# EAGLE design ASD2612 (EAGLE 6.3)
DATABASE: ./../../../../../Components/TinyCircuits_Part_Database.txt
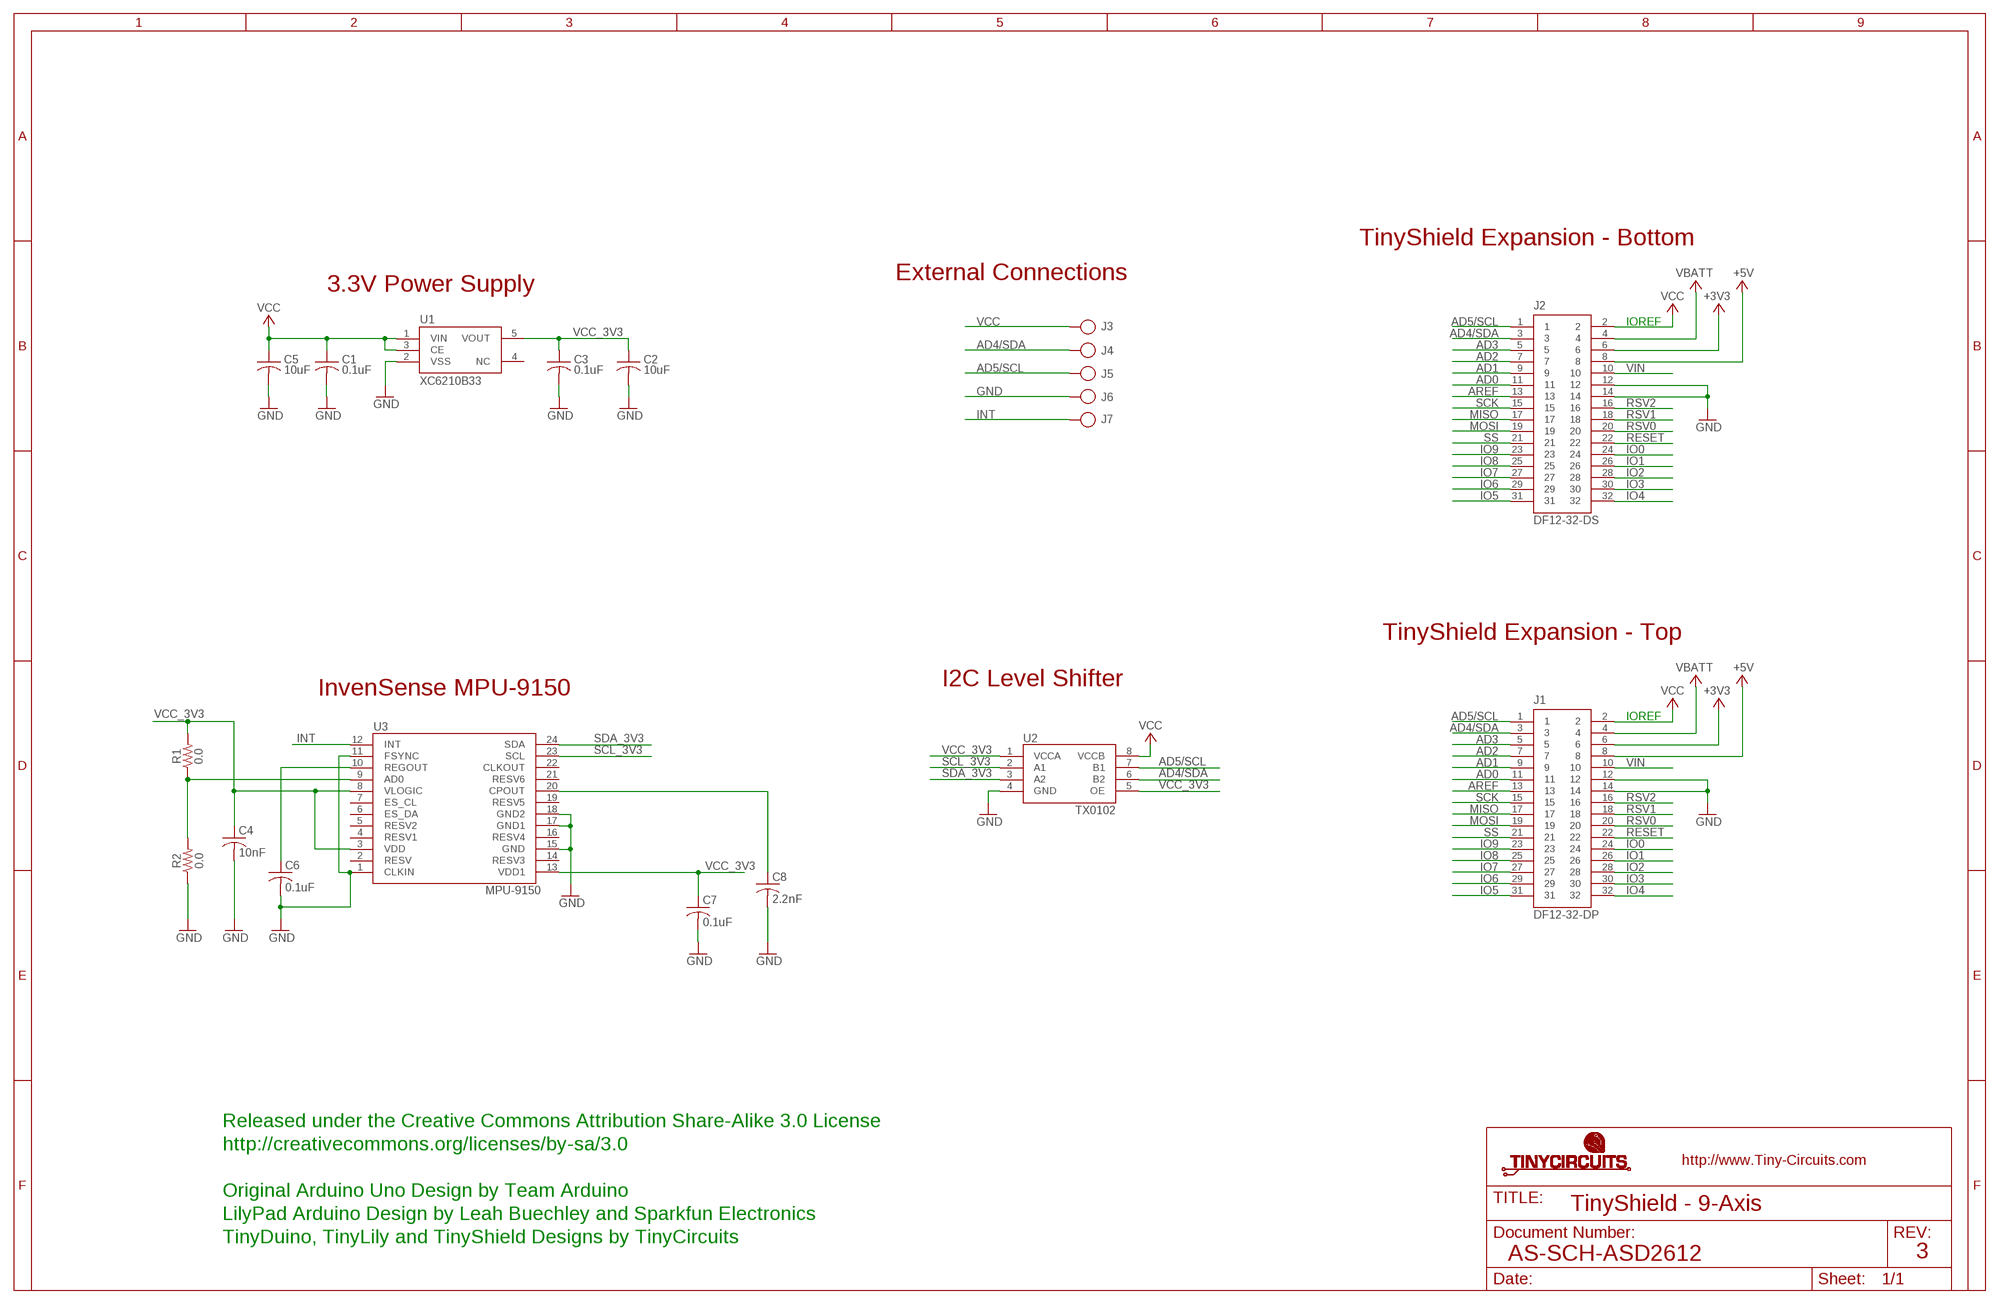
[diagram p0: schematic, sheet 1]

## Parts
C1  0.1uF  AS-ITM-00008  [C0402]
C2  10uF  AS-ITM-00045  [C0805]
C3  0.1uF  AS-ITM-00008  [C0402]
C4  10nF  AS-ITM-00084  [C0402]
C5  10uF  AS-ITM-00045  [C0805]
C6  0.1uF  AS-ITM-00008  [C0402]
C7  0.1uF  AS-ITM-00008  [C0402]
C8  2.2nF  AS-ITM-00085  [C0402]
J1  DF12-32-DP  AS-ITM-00015  [DF12-32-DP]
J2  DF12-32-DS  AS-ITM-00012  [DF12-32-DS]
J3  PIN_1X.1"  [1X.1"]
J4  PIN_1X.1"  [1X.1"]
J5  PIN_1X.1"  [1X.1"]
J6  PIN_1X.1"  [1X.1"]
J7  PIN_1X.1"  [1X.1"]
R1  0.0  AS-ITM-00076  [0402]
R2  AS-ITM-000760402_SHORT  [0402_SHORT]
U1  XC6210B33  AS-ITM-00046  [SOT-25]
U2  TX0102  AS-ITM-00073  [DQE(R-PX2SON-N8)]
U3  MPU-9150  AS-ITM-00081  [MPU-9150]

## Nets
+3V3: J1.6 J2.6
+5V: J1.8 J2.8
AD0: J1.11 J2.11
AD1: J1.9 J2.9
AD2: J1.7 J2.7
AD3: J1.5 J2.5
AD4/SDA: J1.3 J2.3 J4.1 U2.6(B2)
AD5/SCL: J1.1 J2.1 J5.1 U2.7(B1)
AREF: J1.13 J2.13
GND: C1.2 C2.2 C3.2 C4.2 C5.2 C6.2 C7.2 C8.2 J1.12 J1.14 J2.12 J2.14 J6.1 R2.1 U1.2(VSS) U2.4(GND) U3.1(CLKIN) U3.11(FSYNC) U3.15(GND) U3.17(GND1) U3.18(GND2)
INT: J7.1 U3.12(INT)
IO0: J1.24 J2.24
IO1: J1.26 J2.26
IO2: J1.28 J2.28
IO3: J1.30 J2.30
IO4: J1.32 J2.32
IO5: J1.31 J2.31
IO6: J1.29 J2.29
IO7: J1.27 J2.27
IO8: J1.25 J2.25
IO9: J1.23 J2.23
MISO: J1.17 J2.17
MOSI: J1.19 J2.19
N$1: C8.1 U3.20(CPOUT)
N$2: C6.1 U3.10(REGOUT)
N$3: R1.1 R2.2 U3.9(AD0)
RESET: J1.22 J2.22
RSV0: J1.20 J2.20
RSV1: J1.18 J2.18
RSV2: J1.16 J2.16
SCK: J1.15 J2.15
SCL_3V3: U2.2(A1) U3.23(SCL)
SDA_3V3: U2.3(A2) U3.24(SDA)
SS: J1.21 J2.21
VBATT: J1.4 J2.4
VCC: C1.1 C5.1 J1.2 J2.2 J3.1 U1.1(VIN) U1.3(CE) U2.8(VCCB)
VCC_3V3: C2.1 C3.1 C4.1 C7.1 R1.2 U1.5(VOUT) U2.1(VCCA) U2.5(OE) U3.3(VDD) U3.8(VLOGIC) U3.13(VDD1)
VIN: J1.10 J2.10
Unconnected: U1.4(NC) U3.2(RESV) U3.4(RESV1) U3.5(RESV2) U3.6(ES_DA) U3.7(ES_CL) U3.14(RESV3) U3.16(RESV4) U3.19(RESV5) U3.21(RESV6) U3.22(CLKOUT)

## Notes on the sheet
- TinyShield Expansion - Bottom
- External Connections
- 3.3V Power Supply
- IOREF
- TinyShield Expansion - Top
- I2C Level Shifter
- InvenSense MPU-9150
- IOREF
- 0.0
- Released under the Creative Commons Attribution Share-Alike 3.0 License
- http://creativecommons.org/licenses/by-sa/3.0
- Original Arduino Uno Design by Team Arduino
- TinyShield - 9-Axis
- LilyPad Arduino Design by Leah Buechley and Sparkfun Electronics
- TinyDuino, TinyLily and TinyShield Designs by TinyCircuits
- AS-SCH-ASD2612 | 3

## Library data of the parts
C1 C3 C6 C7 = tinycircuits:AS-ITM-00008: CAP CER 0.1UF 16V 10% X5R 0402; PARTNO: AS-ITM-00008
C2 C5 = tinycircuits:AS-ITM-00045: CAP CER 16UF 16V 20% X5R 0805; PARTNO: AS-ITM-00045
C4 = tinycircuits:AS-ITM-00084: CAP CER 10NF 25V 10% X7R 0402; PARTNO: AS-ITM-00084
C8 = tinycircuits:AS-ITM-00085: CAP CER 2.2NF 50V 10% X7R 0402; PARTNO: AS-ITM-00085
J1 = tinycircuits:AS-ITM-00015: CONN HEADER 32POS 3MM SMD 0.5MM; PARTNO: AS-ITM-00015
J2 = tinycircuits:AS-ITM-00012: CONN RECEPT 32POS 3MM SMD 0.5MM; PARTNO: AS-ITM-00012
J3-J7 = tinycircuits:PIN_1X.1": 1 Pin 0.100" Header
R1 = tinycircuits:AS-ITM-00076: RES 0.0 OHM 1/16W 1% 0402 SMD; PARTNO: AS-ITM-00076
R2 = tinycircuits:AS-ITM-00076: RES 0.0 OHM 1/16W 1% 0402 SMD; VALUE: SHORT
U1 = tinycircuits:AS-ITM-00046: IC REG LDO 3.3V .7A SOT-25; PARTNO: AS-ITM-00046
U2 = tinycircuits:AS-ITM-00073: TI 2-Bit Bidirectional Voltage-Level Translator; PARTNO: AS-ITM-00073; VALUE: TXS0102
U3 = tinycircuits:AS-ITM-00081: GYRO/ACCELEROMETER 9-AXIS 24LGA; PARTNO: AS-ITM-00081

## Board
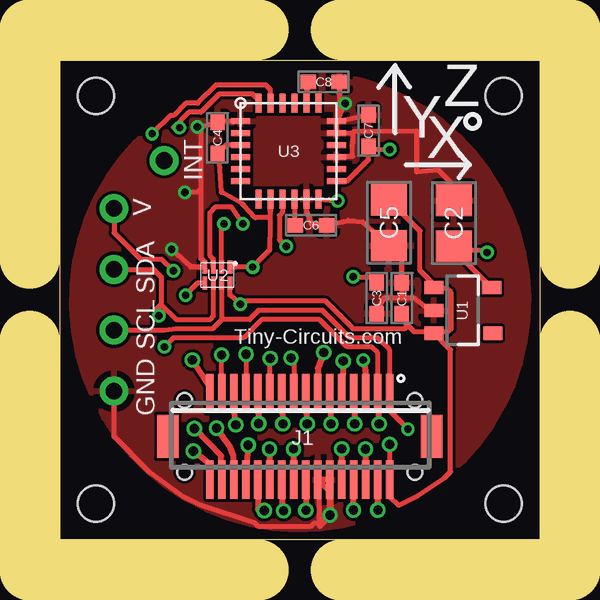
[diagram p1: board, top side]
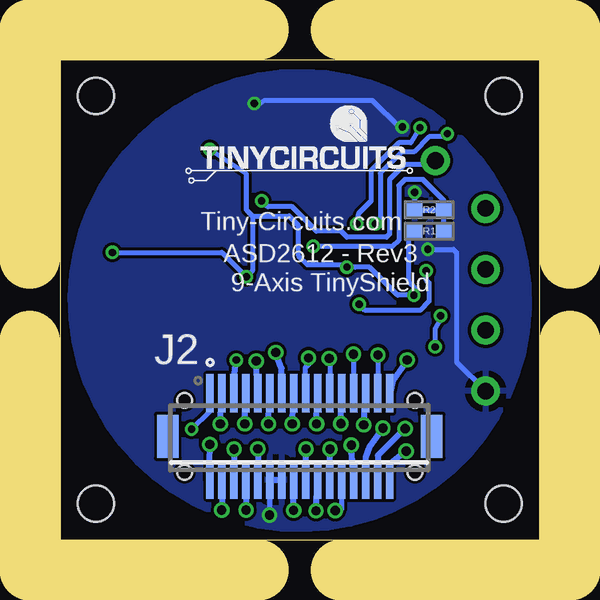
[diagram p2: board, bottom side, seen from below]

Size 20 x 20 mm. Coordinates in mm from the lower left corner, seen from the top.
Outline: 0,20 20,20 20,0 0,0 0,20
Copper layers (1*16): Top 0.035mm / dielectric 1.5mm / Bottom 0.035mm
Design rules "default *": minimum track width 5mil, minimum drill 12mil, track to track 5mil, track to pad 5mil, pad to pad 5mil, via to via 6mil, smd to smd 5mil, copper to edge 6mil, drill to drill 8mil, minimum pad ring 10mil, minimum via ring 5mil, stop-mask expansion 4mil, vias tented up to drill 25mil, thermal gap 10mil
Holes 1.5 mm at 1.5,18.5 18.5,18.5 18.5,1.5 1.5,1.5
Milling: 8 lines

### Footprints (pad centres in the part's own frame; a part is rotated, then mirrored left to right if it is on the bottom)
C0402 = smd 0.65 x 0.6: 1 -0.65,0; 2 0.65,0
C0805 = smd 1.3 x 1.5: 1 -0.95,0; 2 0.95,0
DF12-32-DP = smd 0.3 x 1.6: 1 -3.75,-1.8; 2 -3.75,1.8; 3 -3.25,-1.8; 4 -3.25,1.8; 5 -2.75,-1.8; 6 -2.75,1.8; 7 -2.25,-1.8; 8 -2.25,1.8; 9 -1.75,-1.8; 10 -1.75,1.8; 11 -1.25,-1.8; 12 -1.25,1.8; 13 -0.75,-1.8; 14 -0.75,1.8; 15 -0.25,-1.8; 16 -0.25,1.8; 17 0.25,-1.8; 18 0.25,1.8; 19 0.75,-1.8; 20 0.75,1.8; 21 1.25,-1.8; 22 1.25,1.8; 23 1.75,-1.8; 24 1.75,1.8; 25 2.25,-1.8; 26 2.25,1.8; 27 2.75,-1.8; 28 2.75,1.8; 29 3.25,-1.8; 30 3.25,1.8; 31 3.75,-1.8; 32 3.75,1.8 | smd 0.9 x 1.8: F1 -5.5,0; F2 5.5,0 | hole 0.6: -4.8,1.5; 4.8,1.5
DF12-32-DS = smd 0.3 x 1.6: 1 -3.75,1.8; 2 -3.75,-1.8; 3 -3.25,1.8; 4 -3.25,-1.8; 5 -2.75,1.8; 6 -2.75,-1.8; 7 -2.25,1.8; 8 -2.25,-1.8; 9 -1.75,1.8; 10 -1.75,-1.8; 11 -1.25,1.8; 12 -1.25,-1.8; 13 -0.75,1.8; 14 -0.75,-1.8; 15 -0.25,1.8; 16 -0.25,-1.8; 17 0.25,1.8; 18 0.25,-1.8; 19 0.75,1.8; 20 0.75,-1.8; 21 1.25,1.8; 22 1.25,-1.8; 23 1.75,1.8; 24 1.75,-1.8; 25 2.25,1.8; 26 2.25,-1.8; 27 2.75,1.8; 28 2.75,-1.8; 29 3.25,1.8; 30 3.25,-1.8; 31 3.75,1.8; 32 3.75,-1.8 | smd 0.9 x 1.8: F1 -5.5,0; F2 5.5,0 | hole 0.6: -4.8,1.5; 4.8,1.5
1X.1" = drill 0.7 pad 1.016: 1 0,0
0402 = smd 0.65 x 0.55: 1 -0.6,0; 2 0.6,0
0402_SHORT = smd 0.65 x 0.55: 1 -0.6,0; 2 0.6,0
SOT-25 = smd 0.55 x 0.8: 1 -0.95,-1.2; 2 0,-1.2; 3 0.95,-1.2; 4 0.95,1.25; 5 -0.95,1.2
DQE(R-PX2SON-N8) = smd 0.2 x 0.53: 1 -0.525,-0.335; 2 -0.175,-0.335; 3 0.175,-0.335; 4 0.525,-0.335; 5 0.525,0.335; 6 0.175,0.335; 7 -0.175,0.335; 8 -0.525,0.335
MPU-9150 = smd 0.8 x 0.25: 1 -2,1.25; 2 -2,0.75; 3 -2,0.25; 4 -2,-0.25; 5 -2,-0.75; 6 -2,-1.25; 13 2,-1.25; 14 2,-0.75; 15 2,-0.25; 16 2,0.25; 17 2,0.75; 18 2,1.25 | smd 0.25 x 0.8: 7 -1.25,-2; 8 -0.75,-2; 9 -0.25,-2; 10 0.25,-2; 11 0.75,-2; 12 1.25,-2; 19 1.25,2; 20 0.75,2; 21 0.25,2; 22 -0.25,2; 23 -0.75,2; 24 -1.25,2

### Placement (x,y rotation side)
C1  14.26,10.07 90 top
C2  16.43,13.19 90 top
C3  13.21,10.07 270 top
C4  6.57,16.75 90 top
C5  13.72,13.22 270 top
C6  10.47,13.11 0 top
C7  12.87,17.05 90 top
C8  11,19.08 0 top
J1  10,4.3 180 top
J2  10,4.3 0 bottom
J3  2.25,13.81 0 top
J4  2.25,11.27 0 top
J5  2.25,8.73 0 top
J6  2.25,6.19 0 top
J7  4.34,15.81 0 top
R1  4.61,12.86 180 bottom
R2  4.61,13.75 0 bottom
U1  16.8,9.56 270 top
U2  6.57,11.03 180 top
U3  9.53,16.2 0 top
U$1  [DOCFIELD-TINYCIRCUITS-PCB]  33.91,-10 0 top  (outside the outline)

### Tracks (layer width: path | path; a pad name or v marks a point on that pad's centre or on a via)
+3V3  (via drill 0.38)
  Top 0.254: J2.6 v12.75,3.77 v12.74,3.77
  Bottom 0.254: v12.74,3.77 12.74,2.51 J2.6
+5V  (via drill 0.38)
  Top 0.254: v12.24,1.23 J2.8
  Bottom 0.254: J2.8 12.25,1.21 v12.24,1.23
AD0  (via drill 0.38)
  Top 0.254: v11.3,4.83 11.31,5.05 J2.11
  Bottom 0.254: J2.11 11.28,5.79 v11.3,4.83
AD1  (via drill 0.38)
  Top 0.254: J2.9 11.79,6.27 v11.81,7.44
  Bottom 0.254: v11.81,7.44 11.78,6.22 J2.9
AD2  (via drill 0.38)
  Top 0.254: v12.29,4.83 12.31,5.05 J2.7
  Bottom 0.254: J2.7 12.27,5.86 v12.29,4.83
AD3  (via drill 0.3)
  Top 0.254: J2.5 12.73,7.04 v12.65,7.49
  Bottom 0.254: v12.65,7.49 12.78,6.3 J2.5
AD4/SDA  (via drill 0.3, 0.38)
  Top 0.203: J2.3 13.25,7.77 12.99,8.03 11.97,8.03 10.83,9.18 8.41,9.18 7.65,8.41 4.73,8.41 v4.35,8.03 | J4.1 3.91,11.27 4.22,10.95 4.22,9.81 | 4.22,9.81 4.86,9.18 6.26,9.18 6.39,9.32 U2.6 | v4.12,9.33 3.97,9.56 4.22,9.81
  Top 0.254: v13.31,4.83 13.31,5 J2.3
  Bottom 0.203: v4.35,8.03 4.35,8.8 4.12,9.2 v4.12,9.33
  Bottom 0.254: J2.3 13.28,5.86 v13.31,4.83
AD5/SCL  (via drill 0.3)
  Top 0.203: v14.51,4.61 13.75,5.37 J2.1 13.75,7.91 13.24,8.41 12.1,8.41 10.95,9.56 8.29,9.56 7.91,9.18 6.76,9.18 6.75,9.16 | J5.1 4.36,8.73 4.86,8.8 6.38,8.8 6.75,9.16 | U2.7 6.75,9.16
  Bottom 0.203: v14.51,4.61 13.75,5.37 J2.1
AREF  (via drill 0.38)
  Top 0.254: J2.13 10.75,7.15 v11,7.8
  Bottom 0.254: v11,7.8 10.76,7.14 J2.13
GND  (via drill 0.3, 0.38)
  Top 0.203: v11.26,1.02 J2.12 11.25,1.09 10.83,0.67 | 11.3,1.95 11.3,1.14 | 11.3,1.14 11.29,1.13 11.29,1.09 | 11.37,1.01 11.3,1.01 11.28,1.03 11.28,0.92 11.22,0.86 11.22,1.87 11.27,1.93 11.27,1.97 J2.14 10.83,2.42 10.83,0.67 | U1.2 15.4,9.56 14.77,10.07 14.26,10.07 | 14.26,10.07 13.5,10.07 13.37,9.81 13.37,9.45 C3.2 | 14.26,10.07 C1.2 14.26,11.73 C5.2 12.61,13.26 12.03,13.31 C6.2 10.48,13.15 10.3,13.67 10.3,14.44 U3.11 | C2.2 16.43,14.76 15.78,15.4 14.87,15.32 14.87,17.05 12.28,17.03 12.23,16.98 | C7.2 11.61,17.43 U3.18 | C8.2 11.65,17.89 U3.18 | U3.1 6.83,17.48 C4.2 5.88,17.21 | U3.18 U3.17 11.72,16.94 12.23,16.98 | 12.2,15.98 11.33,15.96 U3.15 11.81,15.97 12.2,15.98 | 12.2,15.98 12.23,16.98 | 11.3,1.14 11.3,1.01 10.83,0.54 10.83,0.67 | 10.83,0.67 10.57,0.67 10.45,0.54 8.29,0.54 8.16,0.67 5.88,1.43 5.11,1.81 3.72,2.83 2.25,4.29 J6.1 | 5.88,14.64 5.88,11.72 6.05,11.55 U2.4 5.47,11.36 v4.66,12.1 | 5.88,14.64 5.88,17.21 | v5.21,14.49 5.75,14.51 5.88,14.64 | U3.18 11.62,17.62 v11.89,18.19 | v5.72,17.2 5.65,17.18 5.88,17.21
  Top 0.254: J2.12 J2.14
  Bottom 0.203: v11.26,1.02 11.25,1.21 J2.12 | R2.1 5.21,14.42 v5.21,14.49 | v11.89,18.19 11.64,18.19 11.46,18.32 6.98,18.32 5.88,17.21 5.84,17.21 v5.72,17.2 | v4.66,12.1 3.59,12.1 3.46,11.97 3.46,7.4 J6.1
  Bottom 0.254: J2.12 J2.14
  pour Top: 18.49,5.61 arc180 1.54,14.32 arc180
  pour Bottom: 18.49,5.61 arc180 1.5,14.34 arc180
INT  (via drill 0.3)
  Top 0.203: U3.12 11.23,14.16 v11.59,14.13
  Bottom 0.203: J7.1 4.49,15.65 5.62,15.65 6.26,15.02 6.26,12.73 6.38,12.61 8.03,12.61 8.29,12.86 9.3,12.86 10.32,13.88 11.34,13.88 v11.59,14.13
IO0  (via drill 0.38)
  Top 0.254: J2.24 8.25,1.26 v8.52,1.21
  Bottom 0.203: v8.52,1.21 8.48,1.27 8.25,1.27 J2.24
  Bottom 0.254: J2.24
IO1  (via drill 0.38)
  Top 0.254: v7.85,3.94 J2.26
  Bottom 0.254: 7.85,3.66 J2.26 v7.85,3.94
IO2  (via drill 0.38)
  Top 0.254: v6.53,4.64 7.07,3.89 7.22,3.49 7.29,2.61 7.26,2.51 J2.28
  Bottom 0.254: J2.28 7.24,3.43 7.07,3.88 v6.53,4.64
IO3  (via drill 0.38)
  Top 0.254: J2.30 6.73,3.49 v5.61,4.63
  Bottom 0.254: v5.61,4.63 6.75,3.51 6.77,2.53 J2.30
IO4  (via drill 0.38)
  Top 0.254: J2.32 6.25,3.14 v5.56,3.69
  Bottom 0.254: v5.56,3.69 5.61,3.65 6.21,3.18 6.21,3.14 6.26,3.1 J2.32
IO5  (via drill 0.38)
  Top 0.254: v5.52,7.49 6.23,6.38 J2.31
  Bottom 0.254: J2.31 6.11,6.64 v5.52,7.49
IO6  (via drill 0.38)
  Top 0.203: J2.29 6.75,7.75 6.74,7.76 6.73,7.78 v6.74,7.7
  Top 0.254: J2.29
  Bottom 0.203: v6.74,7.7 6.74,6.11 J2.29
IO7  (via drill 0.38)
  Top 0.254: v7.33,4.78 7.31,4.9 J2.27
  Bottom 0.254: J2.27 7.29,5.76 v7.33,4.78
IO8  (via drill 0.38)
  Top 0.203: v7.76,7.73 7.76,6.11 J2.25
  Bottom 0.203: J2.25 v7.75,7.72 v7.76,7.73
IO9  (via drill 0.38)
  Top 0.254: v8.29,4.83 8.31,4.98 J2.23
  Bottom 0.254: J2.23 8.28,5.59 v8.29,4.83
MISO  (via drill 0.38)
  Top 0.203: v9.63,7.58 9.75,7.46 J2.17
  Bottom 0.203: J2.17 9.76,6.11 9.76,7.17 9.63,7.3 v9.63,7.58
MOSI  (via drill 0.38)
  Top 0.254: v9.3,4.83 9.31,4.95 J2.19
  Bottom 0.254: J2.19 9.27,5.76 v9.3,4.83
N$1
  Top 0.203: C8.1 10.35,18.86 10.3,18.73 10.3,18.2 U3.20
N$2
  Top 0.203: 9.75,13.31 C6.1 9.78,13.15 U3.10
N$3  (via drill 0.3)
  Top 0.203: 9.18,12.48 v9.43,12.23 9.15,12.5 9.15,13.52 9.28,13.65 U3.9
  Bottom 0.203: R1.1 R2.2 4.01,14.16 4.86,15.02 5.62,15.02 5.88,14.77 5.88,12.48 6.13,12.23 v9.43,12.23
RESET  (via drill 0.38)
  Top 0.254: v8.74,3.77 J2.22
  Bottom 0.254: J2.22 8.75,3.69 v8.74,3.77
RSV0  (via drill 0.38)
  Top 0.254: J2.20 9.25,1.2 v9.32,1.2
  Bottom 0.254: v9.32,1.2 J2.20
RSV1  (via drill 0.38)
  Top 0.254: v9.74,3.77 9.74,2.51 J2.18
  Bottom 0.254: J2.18 9.75,3.72 v9.74,3.77
RSV2  (via drill 0.38)
  Top 0.254: J2.16 10.25,1.16 v10.25,1.22
  Bottom 0.254: v10.25,1.22 J2.16
SCK  (via drill 0.38)
  Top 0.254: v10.31,4.83 10.31,4.98 J2.15
  Bottom 0.254: J2.15 10.29,5.66 v10.31,4.83
SCL_3V3  (via drill 0.3)
  Top 0.203: v3.84,16.92 4.61,17.69 4.73,17.69 5.24,18.19 5.75,18.19 6.51,18.96 8.59,18.96 8.78,18.77 U3.23 | U2.2 6.74,11.38 6.74,13.06 v6.84,13.16 6.76,13.09
  Bottom 0.203: v3.84,16.92 3.97,16.8 4.61,16.8 5.24,16.16 5.75,16.16 6.64,15.27 6.64,13.37 v6.84,13.16
SDA_3V3  (via drill 0.3)
  Top 0.203: U3.24 8.25,18.36 8.03,18.57 6.64,18.57 5.88,17.81 5.37,17.81 4.73,17.18 v4.99,17.18 | U2.3 6.39,11.7 6.26,11.84 6.26,13.62 6.51,13.88 7.14,13.88 v7.63,13.16
  Bottom 0.203: v4.99,17.18 5.37,16.54 5.88,16.54 7.02,15.4 7.02,14.13 7.53,13.62 v7.63,13.16
SS  (via drill 0.38)
  Top 0.203: J2.21 8.77,6.12 v8.77,7.55
  Bottom 0.203: v8.77,7.55 8.75,7.53 J2.21
VBATT  (via drill 0.38)
  Top 0.254: v13.25,1.23 J2.4
  Bottom 0.254: J2.4 13.25,1.24 v13.25,1.23
VCC  (via drill 0.3, 0.38)
  Top 0.203: J2.2 13.73,2.67 v13.75,3.97 13.75,1.81 14.13,1.43 14.89,1.81 16.04,2.57 16.29,2.83 16.29,7.92 U1.3 | C1.1 14.26,9.18 14.51,8.92 | 14.51,8.92 14.77,8.67 15.54,8.67 U1.3 | C5.1 15.02,12.87 15.02,11.21 15.6,10.63 U1.1 15.63,10.47 16.14,10.47 16.31,10.3 16.31,8.8 16.19,8.67 15.66,8.67 U1.3 | J3.1 2.25,12.8 3.36,11.69 4.25,11.69 v4.73,11.21 4.73,11.34 | U2.8 7.09,10.19 v7.53,9.81 7.65,9.94 11.08,9.94 12.23,8.8 14.38,8.8 14.51,8.92
  Bottom 0.203: J2.2 13.77,2.45 | v4.73,11.21 4.73,10.83 4.61,10.7 4.61,9.94 4.99,9.56 7.27,9.56 v7.53,9.81
  Bottom 0.254: 13.77,2.45 v13.75,3.97
VCC_3V3  (via drill 0.3)
  Top 0.203: C2.1 16.43,12.08 | 16.43,12.08 U1.5 | U2.5 5.74,10.69 v5.24,10.19 | U2.1 7.32,11.36 v8.03,11.36 8.75,12.08 U3.8 8.75,13.96 8.77,13.42 8.14,13.42 7.68,13.93 7.6,14 6.74,14.49 6.64,16.04 C4.1 | 6.56,16.06 C4.1 | 12.81,16.29 v13.75,16.26 12.87,16.3 C7.1 12.87,15.84 11.98,14.95 U3.13 | v12.23,10.95 12.98,10.95 C3.1 | 16.43,12.08 17.7,12.08 v17.81,11.97 | U3.3 6.92,16.45 C4.1
  Bottom 0.203: 11.97,13.5 12.23,13.75 12.23,15.25 v13.75,16.26 | 11.97,13.5 10.45,13.5 10.07,13.11 10.07,11.84 9.68,11.46 8.29,11.46 v8.03,11.36 7.68,11.36 U2.1 5.93,10.19 v5.24,10.19 5.21,10.23 5.21,10.49 5.44,10.73 5.44,12.62 R1.2 | 11.97,13.5 11.97,11.21 v12.23,10.95 13.24,11.97 v17.81,11.97
VIN  (via drill 0.38)
  Top 0.254: J2.10 v11.76,3.78 v11.75,3.78
  Bottom 0.254: v11.75,3.78 J2.10

### Text on the board
tPlace: Z | Y | X | INT | V | SDA | Tiny-Circuits.com | SCL | GND
bPlace: Tiny-Circuits.com | ASD2612 - Rev3 | 9-Axis TinyShield
Document: FABRICATION DRAWING | NOTES: | 1. PRINTED CIRCUIT BOARD MADE FROM NEMA GRADE FR-4 EPOXY LAMINATE | WITH 1 OUNCE COPPER PLATING AND .024 THICKNESS. | 2. ALL DIMENSIONS ARE GIVEN IN INCHES. | 3. CIRCUIT PATHS ARE FOR REFERENCE ONLY. | 4. HOLE SIZES SHOWN ARE FINISHED DIAMETERS AFTER PLATING. | 5. BOARD PLATED USING REFLOW OR SIMILAR METHOD. | 6. BOARD TO HAVE BLUE SOLDER MASK ON PLATED SURFACES USING WET FILM | 7. SILKSCREEN BOARD USING WHITE INK. | SR100 OR SR1010 EPOXY. EQUIVALENT WET OR DRY FILM MAY BE USED. | 8. THE FOLLOWING INFORMATION APPLIES TO THIS BOARD: | * 2 COPPER LAYERS | * .024 BOARD THICKNESS | * REQUIRES TOP SIDE SILKSCREEN | Released under the Creative Commons Attribution Share-Alike 3.0 License | http://creativecommons.org/licenses/by-sa/3.0 | Original Arduino Uno Design by Team Arduino | LilyPad Arduino Design by Leah Buechley and Sparkfun Electronics | TinyDuino, TinyLily and TinyShield Designs by TinyCircuits | TinyShield - 9-Axis | AS-PCB-ASD2612 | 3